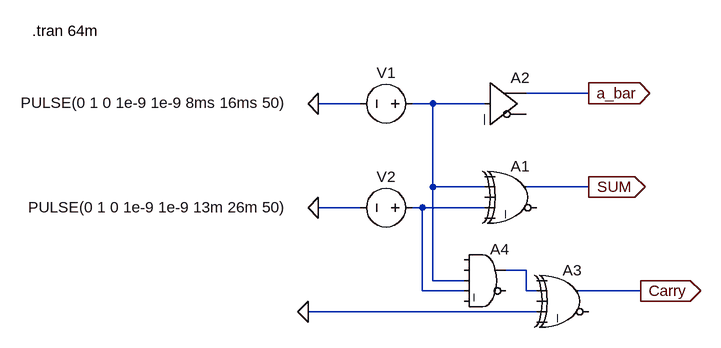
[diagram p0: schematic half_adder.asc]
half_adder.asc, the LTspice schematic file:
Version 4
SHEET 1 880 680
WIRE 304 96 208 96
WIRE -48 112 -112 112
WIRE 64 112 32 112
WIRE 144 112 64 112
WIRE 304 112 304 96
WIRE 64 240 64 112
WIRE 144 240 64 240
WIRE 304 240 208 240
WIRE 304 256 304 240
WIRE -48 272 -112 272
WIRE 48 272 32 272
WIRE 144 272 48 272
WIRE 208 368 176 368
WIRE 64 384 64 240
WIRE 112 384 64 384
WIRE 48 400 48 272
WIRE 112 400 48 400
WIRE 208 400 208 368
WIRE 224 400 208 400
WIRE 384 400 288 400
WIRE 384 416 384 400
WIRE 224 432 -128 432
FLAG 304 96 a_bar
IOPIN 304 96 Out
FLAG 304 240 SUM
IOPIN 304 240 Out
FLAG -112 112 0
FLAG -112 272 0
FLAG 384 400 Carry
IOPIN 384 400 Out
FLAG -128 432 0
SYMBOL Digital\\xor 192 192 R0
SYMATTR InstName A1
SYMBOL Digital\\buf 144 48 R0
SYMATTR InstName A2
SYMBOL voltage 48 112 R90
WINDOW 0 -32 56 VBottom 2
WINDOW 3 -17 412 VTop 2
WINDOW 123 0 0 Left 0
WINDOW 39 0 0 Left 0
SYMATTR InstName V1
SYMATTR Value PULSE(0 1 0 1e-9 1e-9 8ms 16ms 50)
SYMBOL voltage 48 272 R90
WINDOW 0 -32 56 VBottom 2
WINDOW 3 -16 406 VTop 2
WINDOW 123 0 0 Left 0
WINDOW 39 0 0 Left 0
SYMATTR InstName V2
SYMATTR Value PULSE(0 1 0 1e-9 1e-9 13m 26m 50)
SYMBOL Digital\\xor 272 352 R0
SYMATTR InstName A3
SYMBOL Digital\\and 144 320 R0
SYMATTR InstName A4
TEXT -552 0 Left 2 !.tran 64m

The netlist it stands for:
* half_adder.asc
A1 0 N001 0 N002 0 0 SUM 0 XOR
A2 N001 0 0 0 0 0 a_bar 0 BUF
V1 N001 0 PULSE(0 1 0 1e-9 1e-9 8ms 16ms 50)
V2 N002 0 PULSE(0 1 0 1e-9 1e-9 13m 26m 50)
A3 0 N003 0 0 0 0 Carry 0 XOR
A4 0 0 N001 N002 0 0 N003 0 AND
.tran 64m
.backanno
.end